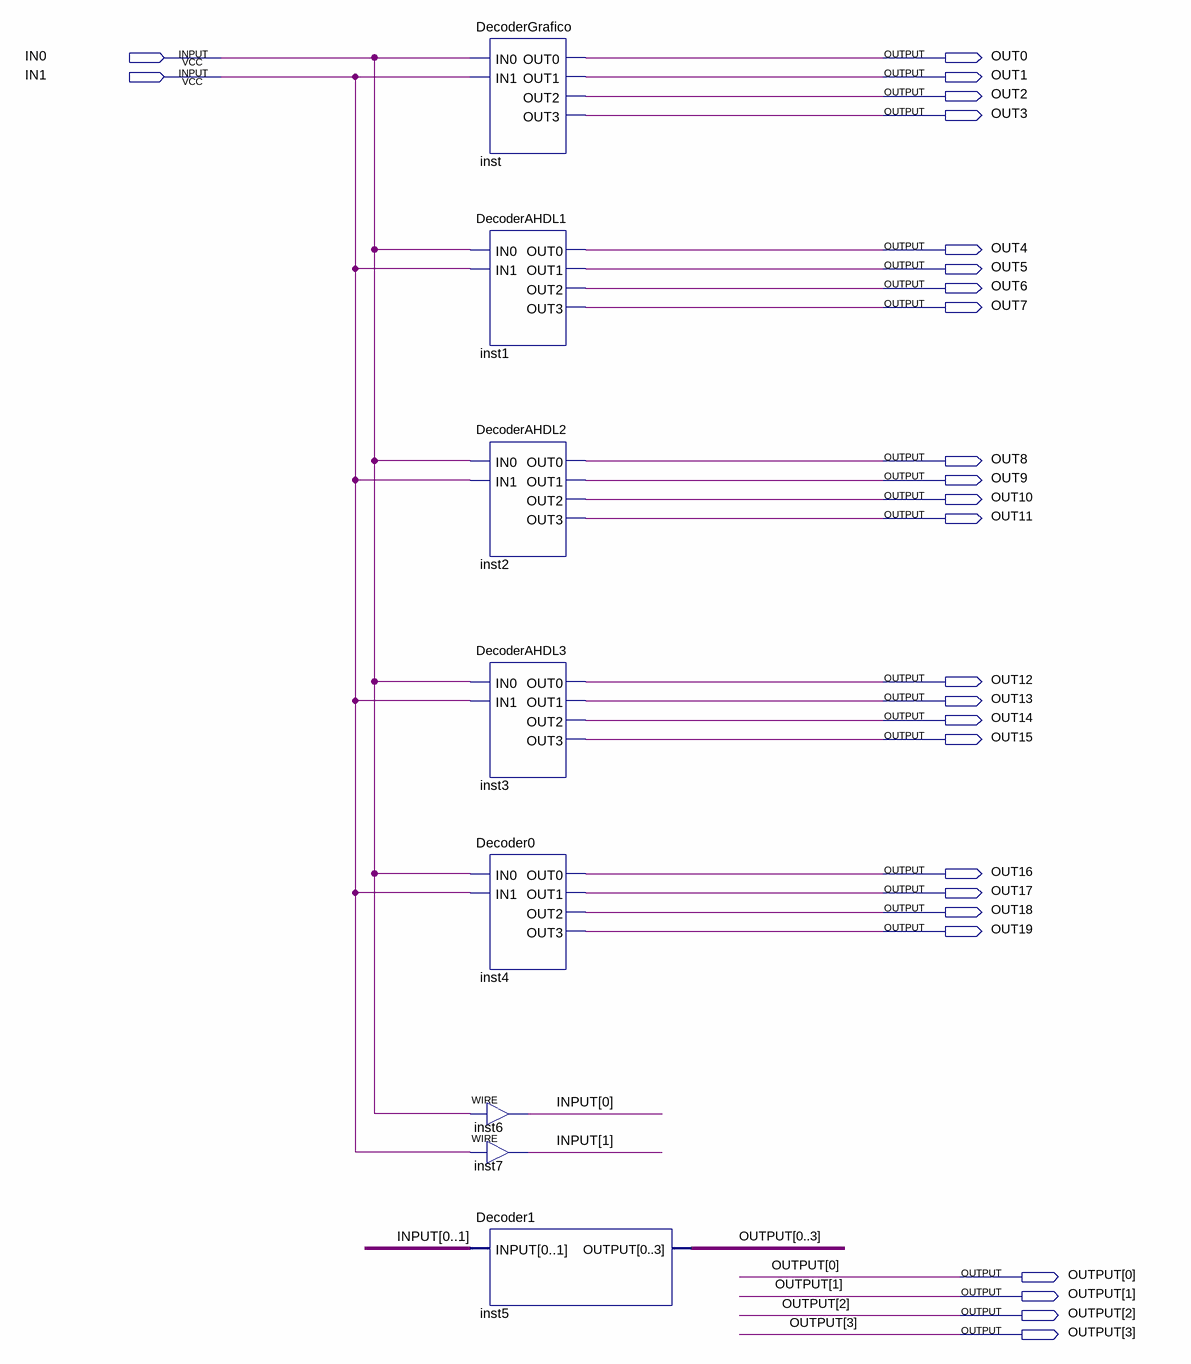
[diagram p0: schematic sheet]
// Quartus schematic DECODER.bdf as structural Verilog: 8 symbols, 26 pins
module DECODER (
  input  IN0,
  input  IN1,
  output OUT0,
  output OUT1,
  output OUT2,
  output OUT3,
  output OUT4,
  output OUT5,
  output OUT6,
  output OUT7,
  output OUT8,
  output OUT9,
  output OUT10,
  output OUT11,
  output OUT12,
  output OUT13,
  output OUT14,
  output OUT15,
  output OUT16,
  output OUT17,
  output OUT18,
  output OUT19,
  output [3:0] OUTPUT
);

  wire [1:0] INPUT;

  DecoderGrafico inst (.IN0(IN0), .IN1(IN1), .OUT0(OUT0), .OUT1(OUT1), .OUT2(OUT2), .OUT3(OUT3));
  DecoderAHDL1 inst1 (.IN0(IN0), .IN1(IN1), .OUT0(OUT4), .OUT1(OUT5), .OUT2(OUT6), .OUT3(OUT7));
  DecoderAHDL2 inst2 (.IN0(IN0), .IN1(IN1), .OUT0(OUT8), .OUT1(OUT9), .OUT2(OUT10), .OUT3(OUT11));
  DecoderAHDL3 inst3 (.IN0(IN0), .IN1(IN1), .OUT0(OUT12), .OUT1(OUT13), .OUT2(OUT14), .OUT3(OUT15));
  Decoder0 inst4 (.IN0(IN0), .IN1(IN1), .OUT0(OUT16), .OUT1(OUT17), .OUT2(OUT18), .OUT3(OUT19));
  assign INPUT[0] = IN0;  // WIRE inst6
  assign INPUT[1] = IN1;  // WIRE inst7
  Decoder1 inst5 (.INPUT({INPUT[0], INPUT[1]}), .OUTPUT({OUTPUT[0], OUTPUT[1], OUTPUT[2], OUTPUT[3]}));
endmodule
